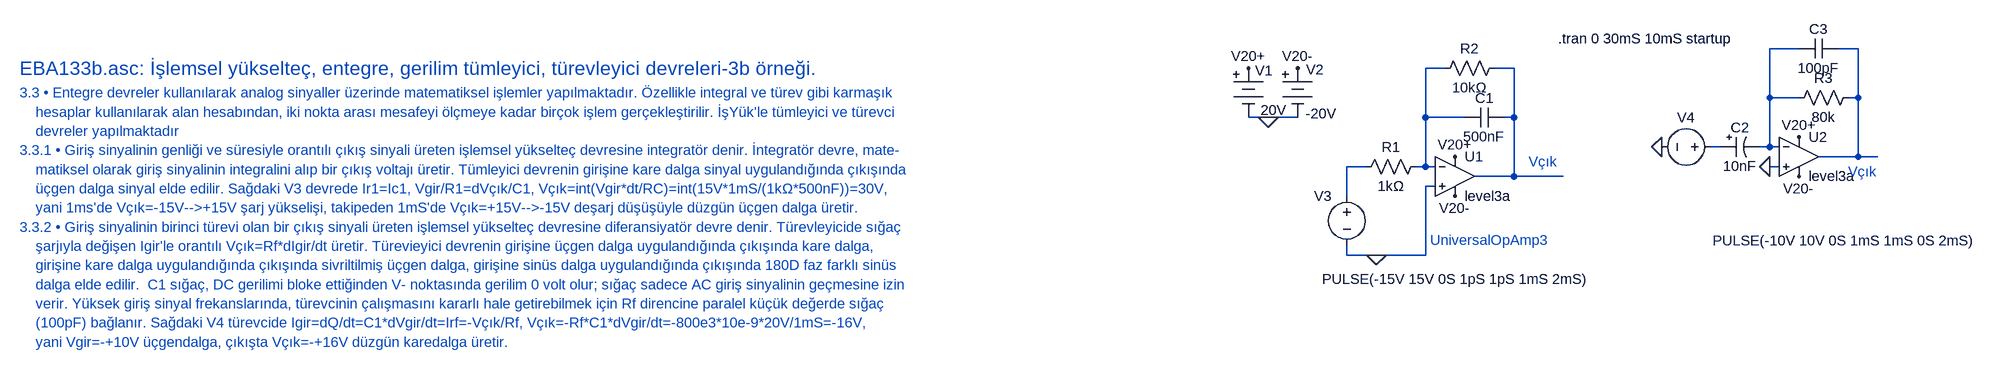
[diagram p0: schematic EBA133b.asc]
EBA133b.asc, the LTspice schematic file:
Version 4
SHEET 1 5332 4332
WIRE 2672 16 2624 16
WIRE 2768 16 2736 16
WIRE 2096 48 2064 48
WIRE 2208 48 2176 48
WIRE 2624 96 2624 16
WIRE 2672 96 2624 96
WIRE 2768 96 2768 16
WIRE 2768 96 2752 96
WIRE 1808 128 1776 128
WIRE 1856 128 1808 128
WIRE 2064 128 2064 48
WIRE 2128 128 2064 128
WIRE 2208 128 2208 48
WIRE 2208 128 2192 128
WIRE 2544 176 2528 176
WIRE 2624 176 2624 96
WIRE 2624 176 2608 176
WIRE 2640 176 2624 176
WIRE 2768 192 2768 96
WIRE 2768 192 2704 192
WIRE 2800 192 2768 192
WIRE 1968 208 1936 208
WIRE 2064 208 2064 128
WIRE 2064 208 2048 208
WIRE 2080 208 2064 208
WIRE 2640 208 2624 208
WIRE 2208 224 2208 128
WIRE 2208 224 2144 224
WIRE 2288 224 2208 224
WIRE 2080 240 2064 240
WIRE 1936 256 1936 208
WIRE 1936 352 1936 336
WIRE 1984 352 1936 352
WIRE 2064 352 2064 240
WIRE 2064 352 1984 352
FLAG 1808 128 0
FLAG 1776 48 V20+
FLAG 1856 48 V20-
FLAG 2112 192 V20+
FLAG 2112 256 V20-
FLAG 1984 352 0
FLAG 2448 176 0
FLAG 2624 208 0
FLAG 2672 160 V20+
FLAG 2672 224 V20-
SYMBOL Misc\\battery 1776 32 R0
WINDOW 0 11 20 Left 2
WINDOW 3 20 84 Left 2
SYMATTR InstName V1
SYMATTR Value 20V
SYMBOL Misc\\battery 1856 32 R0
WINDOW 0 14 18 Left 2
WINDOW 3 13 90 Left 2
SYMATTR InstName V2
SYMATTR Value -20V
SYMBOL res 2064 192 R90
WINDOW 0 0 56 VBottom 2
WINDOW 3 32 56 VTop 2
SYMATTR InstName R1
SYMATTR Value 1kΩ
SYMBOL cap 2192 112 R90
WINDOW 0 0 32 VBottom 2
WINDOW 3 32 32 VTop 2
SYMATTR InstName C1
SYMATTR Value 500nF
SYMBOL voltage 1936 240 M0
WINDOW 3 -402 151 Left 2
WINDOW 123 0 0 Left 0
WINDOW 39 0 0 Left 0
SYMATTR Value PULSE(-15V 15V 0S 1pS 1pS 1mS 2mS)
SYMATTR InstName V3
SYMBOL res 2192 32 R90
WINDOW 0 0 56 VBottom 2
WINDOW 3 32 56 VTop 2
SYMATTR InstName R2
SYMATTR Value 10kΩ
SYMBOL OpAmps\\UniversalOpAmp3 2112 224 R0
SYMATTR InstName U1
SYMBOL OpAmps\\UniversalOpAmp3 2672 192 R0
SYMATTR InstName U2
SYMBOL polcap 2544 160 M90
WINDOW 0 0 32 VBottom 2
WINDOW 3 32 32 VTop 2
SYMATTR InstName C2
SYMATTR Value 10nF
SYMBOL voltage 2544 176 R90
WINDOW 0 -32 56 VBottom 2
WINDOW 3 168 -205 VBottom 2
WINDOW 123 0 0 Left 0
WINDOW 39 0 0 Left 0
SYMATTR InstName V4
SYMATTR Value PULSE(-10V 10V 0S 1mS 1mS 0S 2mS)
SYMBOL res 2768 80 R90
WINDOW 0 0 56 VBottom 2
WINDOW 3 32 56 VTop 2
SYMATTR InstName R3
SYMATTR Value 80k
SYMBOL cap 2736 0 R90
WINDOW 0 0 32 VBottom 2
WINDOW 3 32 32 VTop 2
SYMATTR InstName C3
SYMATTR Value 100pF
TEXT -224 48 Left 3 ;EBA133b.asc: İşlemsel yükselteç, entegre, gerilim tümleyici, türevleyici devreleri-3b örneği.
TEXT -224 88 Left 2 ;3.3 • Entegre devreler kullanılarak analog sinyaller üzerinde matematiksel işlemler yapılmaktadır. Özellikle integral ve türev gibi karmaşık\n    hesaplar kullanılarak alan hesabından, iki nokta arası mesafeyi ölçmeye kadar birçok işlem gerçekleştirilir. İşYük'le tümleyici ve türevci\n    devreler yapılmaktadır\n3.3.1 • Giriş sinyalinin genliği ve süresiyle orantılı çıkış sinyali üreten işlemsel yükselteç devresine integratör denir. İntegratör devre, mate-\n    matiksel olarak giriş sinyalinin integralini alıp bir çıkış voltajı üretir. Tümleyici devrenin girişine kare dalga sinyal uygulandığında çıkışında \n    üçgen dalga sinyal elde edilir. Sağdaki V3 devrede Ir1=Ic1, Vgir/R1=dVçık/C1, Vçık=int(Vgir*dt/RC)=int(15V*1mS/(1kΩ*500nF))=30V,\n    yani 1ms'de Vçık=-15V-->+15V şarj yükselişi, takipeden 1mS'de Vçık=+15V-->-15V deşarj düşüşüyle düzgün üçgen dalga üretir.\n3.3.2 • Giriş sinyalinin birinci türevi olan bir çıkış sinyali üreten işlemsel yükselteç devresine diferansiyatör devre denir. Türevleyicide sığaç \n    şarjıyla değişen Igir'le orantılı Vçık=Rf*dIgir/dt üretir. Türevieyici devrenin girişine üçgen dalga uygulandığında çıkışında kare dalga, \n    girişine kare dalga uygulandığında çıkışında sivriltilmiş üçgen dalga, girişine sinüs dalga uygulandığında çıkışında 180D faz farklı sinüs \n    dalga elde edilir.  C1 sığaç, DC gerilimi bloke ettiğinden V- noktasında gerilim 0 volt olur; sığaç sadece AC giriş sinyalinin geçmesine izin\n    verir. Yüksek giriş sinyal frekanslarında, türevcinin çalışmasını kararlı hale getirebilmek için Rf direncine paralel küçük değerde sığaç\n    (100pF) bağlanır. Sağdaki V4 türevcide Igir=dQ/dt=C1*dVgir/dt=Irf=-Vçık/Rf, Vçık=-Rf*C1*dVgir/dt=-800e3*10e-9*20V/1mS=-16V,\n    yani Vgir=-+10V üçgendalga, çıkışta Vçık=-+16V düzgün karedalga üretir.
TEXT 2232 200 Left 2 ;Vçık
TEXT 2280 0 Left 2 !.tran 0 30mS 10mS startup
TEXT 2072 328 Left 2 ;UniversalOpAmp3
TEXT 2752 216 Left 2 ;Vçık

The netlist it stands for:
* EBA133b.asc
V1 V20+ 0 20V
V2 V20- 0 -20V
R1 N003 N006 1kΩ
C1 N004 N003 500nF
V3 N006 0 PULSE(-15V 15V 0S 1pS 1pS 1mS 2mS)
R2 N004 N003 10kΩ
XU1 0 N003 V20+ V20- N004 level3a  ; pins In+ In- V+ V- OUT
XU2 0 N001 V20+ V20- N002 level3a  ; pins In+ In- V+ V- OUT
C2 N005 N001 10nF
V4 N005 0 PULSE(-10V 10V 0S 1mS 1mS 0S 2mS)
R3 N002 N001 80k
C3 N002 N001 100pF
* EBA133b.asc: İşlemsel yükselteç, entegre, gerilim tümleyici, türevleyici devreleri-3b örneği.
* 3.3 • Entegre devreler kullanılarak analog sinyaller üzerinde matematiksel işlemler yapılmaktadır. Özellikle integral ve türev gibi karmaşık
*     hesaplar kullanılarak alan hesabından, iki nokta arası mesafeyi ölçmeye kadar birçok işlem gerçekleştirilir. İşYük'le tümleyici ve türevci
*     devreler yapılmaktadır
* 3.3.1 • Giriş sinyalinin genliği ve süresiyle orantılı çıkış sinyali üreten işlemsel yükselteç devresine integratör denir. İntegratör devre, mate-
*     matiksel olarak giriş sinyalinin integralini alıp bir çıkış voltajı üretir. Tümleyici devrenin girişine kare dalga sinyal uygulandığında çıkışında
*     üçgen dalga sinyal elde edilir. Sağdaki V3 devrede Ir1=Ic1, Vgir/R1=dVçık/C1, Vçık=int(Vgir*dt/RC)=int(15V*1mS/(1kΩ*500nF))=30V,
*     yani 1ms'de Vçık=-15V-->+15V şarj yükselişi, takipeden 1mS'de Vçık=+15V-->-15V deşarj düşüşüyle düzgün üçgen dalga üretir.
* 3.3.2 • Giriş sinyalinin birinci türevi olan bir çıkış sinyali üreten işlemsel yükselteç devresine diferansiyatör devre denir. Türevleyicide sığaç
*     şarjıyla değişen Igir'le orantılı Vçık=Rf*dIgir/dt üretir. Türevieyici devrenin girişine üçgen dalga uygulandığında çıkışında kare dalga,
*     girişine kare dalga uygulandığında çıkışında sivriltilmiş üçgen dalga, girişine sinüs dalga uygulandığında çıkışında 180D faz farklı sinüs
*     dalga elde edilir.  C1 sığaç, DC gerilimi bloke ettiğinden V- noktasında gerilim 0 volt olur; sığaç sadece AC giriş sinyalinin geçmesine izin
*     verir. Yüksek giriş sinyal frekanslarında, türevcinin çalışmasını kararlı hale getirebilmek için Rf direncine paralel küçük değerde sığaç
*     (100pF) bağlanır. Sağdaki V4 türevcide Igir=dQ/dt=C1*dVgir/dt=Irf=-Vçık/Rf, Vçık=-Rf*C1*dVgir/dt=-800e3*10e-9*20V/1mS=-16V,
*     yani Vgir=-+10V üçgendalga, çıkışta Vçık=-+16V düzgün karedalga üretir.
* Vçık
.tran 0 30mS 10mS startup
* UniversalOpAmp3
* Vçık
.backanno
.end